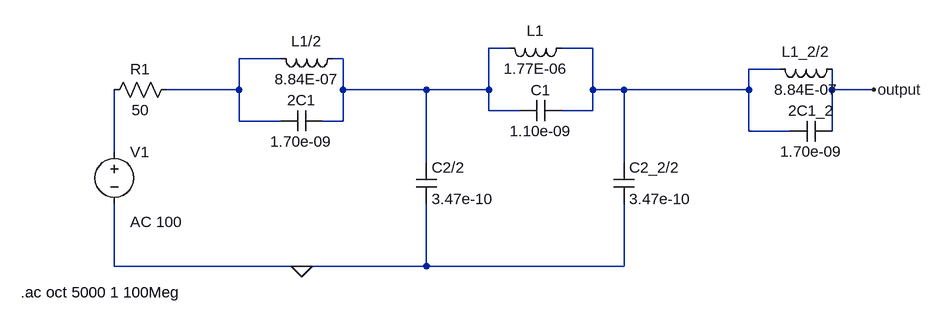
[diagram p0: schematic filtrDolnoprzepustowyRzeczTypuPi.asc]
filtrDolnoprzepustowyRzeczTypuPi.asc, the LTspice schematic file:
Version 4
SHEET 1 1904 680
WIRE 608 -48 576 -48
WIRE 736 -48 688 -48
WIRE 256 -32 192 -32
WIRE 352 -32 336 -32
WIRE 1024 -16 976 -16
WIRE 192 16 192 -32
WIRE 192 16 80 16
WIRE 352 16 352 -32
WIRE 480 16 352 16
WIRE 576 16 576 -48
WIRE 576 16 480 16
WIRE 736 16 736 -48
WIRE 784 16 736 16
WIRE 976 16 976 -16
WIRE 976 16 784 16
WIRE 1104 16 1104 -16
WIRE 1168 16 1104 16
WIRE 576 48 576 16
WIRE 624 48 576 48
WIRE 736 48 736 16
WIRE 736 48 688 48
WIRE 192 64 192 16
WIRE 256 64 192 64
WIRE 352 64 352 16
WIRE 352 64 320 64
WIRE 976 80 976 16
WIRE 1040 80 976 80
WIRE 1104 80 1104 16
WIRE 0 112 0 16
WIRE 480 128 480 16
WIRE 784 128 784 16
WIRE 0 288 0 192
WIRE 288 288 0 288
WIRE 480 288 480 192
WIRE 480 288 288 288
WIRE 784 288 784 192
WIRE 784 288 480 288
FLAG 288 288 0
FLAG 1168 16 output
SYMBOL voltage 0 96 R0
WINDOW 123 24 124 Left 2
WINDOW 39 0 0 Left 0
SYMATTR Value2 AC 100
SYMATTR InstName V1
SYMATTR Value ""
SYMBOL ind 352 -48 R90
WINDOW 0 5 56 VBottom 2
WINDOW 3 32 56 VTop 2
SYMATTR InstName L1/2
SYMATTR Value 8.84E-07
SYMBOL cap 320 48 R90
WINDOW 0 0 32 VBottom 2
WINDOW 3 32 32 VTop 2
SYMATTR InstName 2C1
SYMATTR Value 1.70e-09
SYMBOL cap 464 128 R0
SYMATTR InstName C2/2
SYMATTR Value 3.47e-10
SYMBOL res 96 0 R90
WINDOW 0 0 56 VBottom 2
WINDOW 3 32 56 VTop 2
SYMATTR InstName R1
SYMATTR Value 50
SYMBOL ind 704 -64 R90
WINDOW 0 5 56 VBottom 2
WINDOW 3 32 56 VTop 2
SYMATTR InstName L1
SYMATTR Value 1.77E-06
SYMBOL cap 688 32 R90
WINDOW 0 0 32 VBottom 2
WINDOW 3 32 32 VTop 2
SYMATTR InstName C1
SYMATTR Value 1.10e-09
SYMBOL ind 1120 -32 R90
WINDOW 0 5 56 VBottom 2
WINDOW 3 32 56 VTop 2
SYMATTR InstName L1_2/2
SYMATTR Value 8.84E-07
SYMBOL cap 1104 64 R90
WINDOW 0 0 32 VBottom 2
WINDOW 3 32 32 VTop 2
SYMATTR InstName 2C1_2
SYMATTR Value 1.70e-09
SYMBOL cap 768 128 R0
SYMATTR InstName C2_2/2
SYMATTR Value 3.47e-10
TEXT -144 328 Left 2 !.ac oct 5000 1 100Meg

The netlist it stands for:
* filtrDolnoprzepustowyRzeczTypuPi.asc
V1 N004 0 AC 100
L1/2 N001 N003 8.84E-07
C§2C1 N001 N003 1.70e-09
C2/2 N001 0 3.47e-10
R1 N003 N004 50
L1 N002 N001 1.77E-06
C1 N002 N001 1.10e-09
L1_2/2 output N002 8.84E-07
C§2C1_2 output N002 1.70e-09
C2_2/2 N002 0 3.47e-10
.ac oct 5000 1 100Meg
.backanno
.end